# EAGLE design lp_pic32_s (EAGLE 7.5.0)
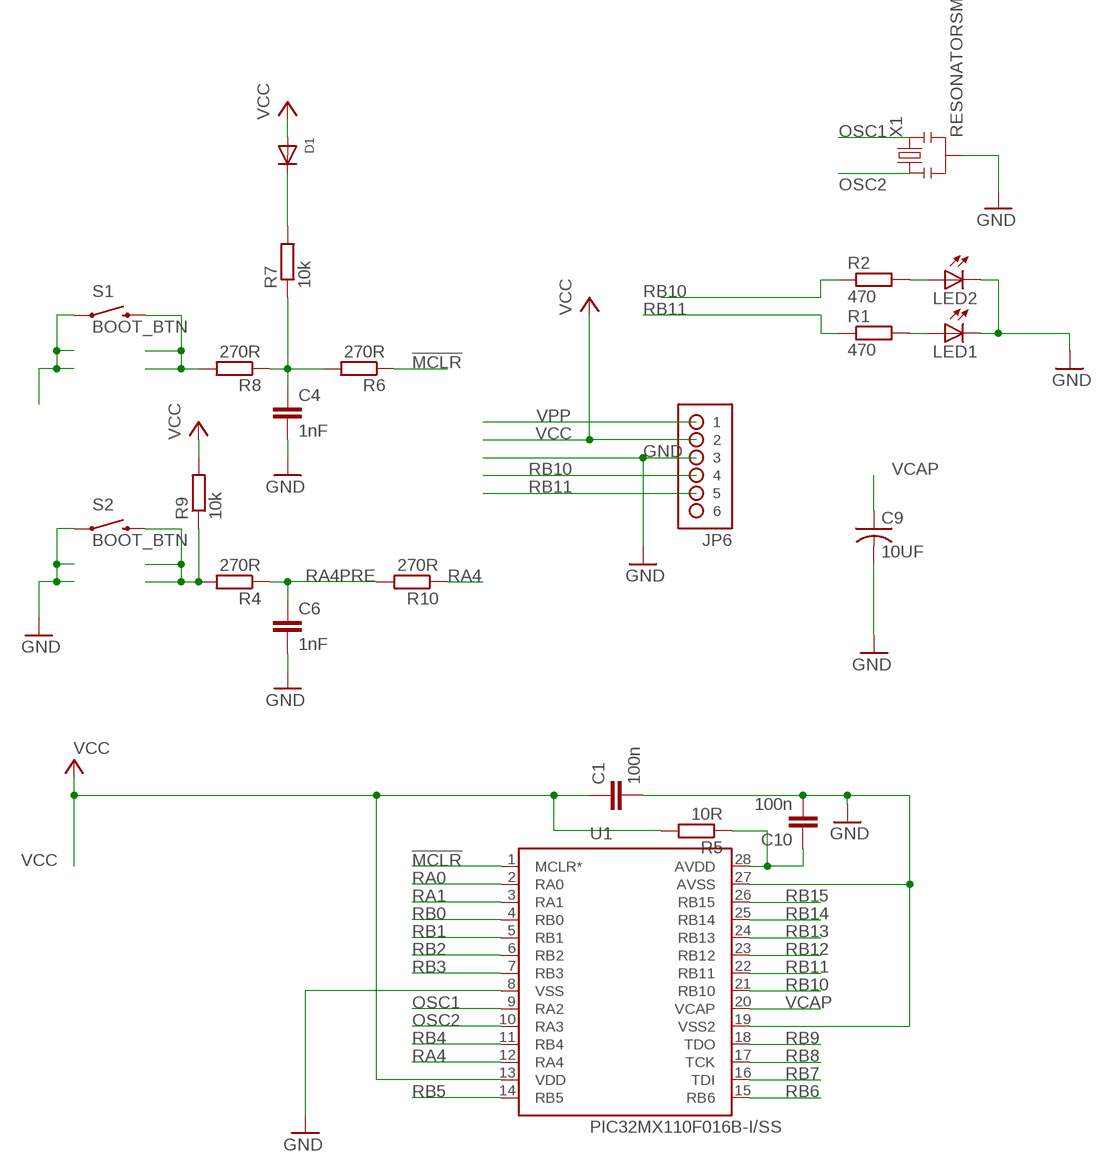
[diagram p0: schematic, sheet 1]

## Parts
C1  100n  C-EUC0805  [C0805]
C4  1nF  C-EUC0805  [C0805]
C6  1nF  C-EUC0805  [C0805]
C9  10UF  C-USC1206  [C1206]
C10  100n  C-EUC0805  [C0805]
D1  DIODESOD-323F  [SOD-323F]
JP6  No Load  HDR-1X6-OFFSET  [HDR-1X6_OFFSET]
LED1  0  LEDCHIPLED_1206  [CHIPLED_1206]
LED2  0  LEDCHIPLED_1206  [CHIPLED_1206]
R1  470  R-EU_R0805  [R0805]
R2  470  R-EU_R0805  [R0805]
R4  270R  R-EU_R0805  [R0805]
R5  10R  R-EU_R0805  [R0805]
R6  270R  R-EU_R0805  [R0805]
R7  10k  R-EU_R0805  [R0805]
R8  270R  R-EU_R0805  [R0805]
R9  10k  R-EU_R0805  [R0805]
R10  270R  R-EU_R0805  [R0805]
S1  BOOT_BTN  SWITCH-MOMENTARY-2-SMD-1101NE  [TACTILE-SWITCH-1101NE]
S2  BOOT_BTN  SWITCH-MOMENTARY-2-SMD-1101NE  [TACTILE-SWITCH-1101NE]
U1  PIC32MX110F016B-I/SS  [SOP65P780X200-28N]
X1  RESONATORSMD  [RESONATOR-SMD]

## Nets
!MCLR: R6.1 U1.1(MCLR*)
GND [GND]: C1.2 C4.2 C6.2 C9.2 C10.2 JP6.3 LED1.C LED2.C S2.1 U1.8(VSS) U1.19(VSS2) U1.27(AVSS) X1.2
N$4: R4.2 R9.1 S2.2
N$5: R8.2 S1.2
N$7: D1.C R7.2
N$8 [VCC]: C10.1 R5.1 U1.28(AVDD)
N$9 [GND]: S1.1
N$13: LED1.A R1.2
N$14: LED2.A R2.2
OSC1: U1.9(RA2) X1.3
OSC2: U1.10(RA3) X1.1
RA0: U1.2(RA0)
RA1: U1.3(RA1)
RA4: R10.1 U1.12(RA4)
RA4PRE: C6.1 R4.1 R10.2
RB0: U1.4(RB0)
RB1: U1.5(RB1)
RB2: U1.6(RB2)
RB3: U1.7(RB3)
RB4: U1.11(RB4)
RB5: U1.14(RB5)
RB6: U1.15(RB6)
RB7: U1.16(TDI)
RB8: U1.17(TCK)
RB9: U1.18(TDO)
RB10: JP6.4 R2.1 U1.21(RB10)
RB11: JP6.5 R1.1 U1.22(RB11)
RB12: U1.23(RB12)
RB13: U1.24(RB13)
RB14: U1.25(RB14)
RB15: U1.26(RB15)
VCAP: C9.1 U1.20(VCAP)
VCC [VCC]: C1.1 D1.A JP6.2 R5.2 R9.2 U1.13(VDD)
VPP: C4.1 JP6.1 R6.2 R7.1 R8.1
Unconnected: JP6.6

## Library data of the parts
C1 C10 = rcl:C-EU: CAPACITOR, European symbol
C4 C6 = resistor:C-EU: CAPACITOR, European symbol
C9 = rcl:C-US: CAPACITOR, American symbol
D1 = adafruit:DIODE: Diode SMADIODE - SMA Surface Mount Package 20V 1A Schottky Diode Digikey: 641-1014-6-ND DO-1N4148 - Through Hole Small Current Diode SOD-123 20V 1 A (.5mV Vf) Schottky Diode - Digikey: MBRX120TPMSCT-ND SOD-323 10V 570mA (.38mV Vf, 3ns) Schottky Diode - Digikey: ZLLS410CT-ND SOD-523 30V 30mA Schottky Diode (RB751S-40TE61) - Digikey: RB751S-40TE61CT-ND SOT23-R/W - SOT23 Package (R = Solder Paste/Reflow Ovens, W = Hand-Soldering) BAT54Film 40V 300mA - Digikey: 497-7162-1-ND
JP6 = Mechanical:HDR-1X6-OFFSET: 42 mil hole pattern with 16mil offset for jtag connector
LED1 LED2 = led:LED: LED OSRAM: - CHIPLED LG R971, LG N971, LY N971, LG Q971, LY Q971, LO R971, LY R971 LH N974, LH R974 LS Q976, LO Q976, LY Q976 LO Q996 - Hyper CHIPLED LW Q18S LB Q993, LB Q99A, LB R99A - SideLED LS A670, LO A670, LY A670, LG A670, LP A670 LB A673, LV A673, LT A673, LW A673 LH A674 LY A675 LS A676, LA A676, LO A676, LY A676, LW A676 LS A679, LY A679, LG A679 - Hyper Micro SIDELED® LS Y876, LA Y876, LO Y876, LY Y876 LT Y87S - SmartLED LW L88C, LW L88S LB L89C, LB L89S, LG L890 LS L89K, LO L89K, LY L89K LS L896, LA L896, LO L896, LY L896 - TOPLED LS T670, LO T670, LY T670, LG T670, LP T670 LSG T670, LSP T670, LSY T670, LOP T670, LYG T670 LG T671, LOG T671, LSG T671 LB T673, LV T673, LT T673, LW T673 LH T674 LS T676, LA T676, LO T676, LY T676, LB T676, LH T676, LSB T676, LW T676 LB T67C, LV T67C, LT T67C, LS T67K, LO T67K, LY T67K, LW E67C LS E67B, LA E67B, LO E67B, LY E67B, LB E67C, LV E67C, LT E67C LW T67C LS T679, LY T679, LG T679 LS T770, LO T770, LY T770, LG T770, LP T770 LB T773, LV T773, LT T773, LW T773 LH T774 LS E675, LA E675, LY E675, LS T675 LS T776, LA T776, LO T776, LY T776, LB T776 LHGB T686 LT T68C, LB T68C - Hyper Mini TOPLED® LB M676 - Mini TOPLED Santana® LG M470 LS M47K, LO M47K, LY M47K Source: http://www.osram.convergy.de LUXEON: - LUMILED® LXK2-PW12-R00, LXK2-PW12-S00, LXK2-PW14-U00, LXK2-PW14-V00 LXK2-PM12-R00, LXK2-PM12-S00, LXK2-PM14-U00 LXK2-PE12-Q00, LXK2-PE12-R00, LXK2-PE12-S00, LXK2-PE14-T00, LXK2-PE14-U00 LXK2-PB12-K00, LXK2-PB12-L00, LXK2-PB12-M00, LXK2-PB14-N00, LXK2-PB14-P00, LXK2-PB14-Q00 LXK2-PR12-L00, LXK2-PR12-M00, LXK2-PR14-Q00, LXK2-PR14-R00 LXK2-PD12-Q00, LXK2-PD12-R00, LXK2-PD12-S00 LXK2-PH12-R00, LXK2-PH12-S00 LXK2-PL12-P00, LXK2-PL12-Q00, LXK2-PL12-R00 Source: www.luxeon.com KINGBRIGHT: KA-3528ASYC Source: www.kingbright.com
R1 R2 R4-R10 = resistor:R-EU_: RESISTOR, European symbol
S1 S2 = SparkFun-Electromechanical:SWITCH-MOMENTARY-2: Various NO switches- pushbuttons, reed, etc
U1 = Microchip-PIC32MX1-2-3-4-5-6-7:PIC32MX: IC,32-bit Microcontrollers (up to 128 KB Flash and 32 KB SRAM) with Audio and Graphics Interfaces, USB, and Advanced Analog; MPN: PIC32MX110F016B-I/SS; OC_FARNELL: 2057067; OC_NEWARK: 39T6776; PACKAGE: 28-Lead SSOP; SUPPLIER: Microchip
X1 = SparkFun02-20-08:RESONATOR: Resonator Small SMD resonator. This is the itty bitty 10/20MHz resonators with built in caps. CSTCE10M0G55 and CSTCE20M0V53. Footprint has been reviewed closely but hasn t been tested yet.'

## Net classes
0 default: width 0.406 mm, drill 0.508 mm
1 GND: width 0.508 mm, drill 0.508 mm
2 VCC: width 1.016 mm, drill 0.508 mm
4 VCCEXT: width 0.762 mm, drill 0.508 mm

## Board
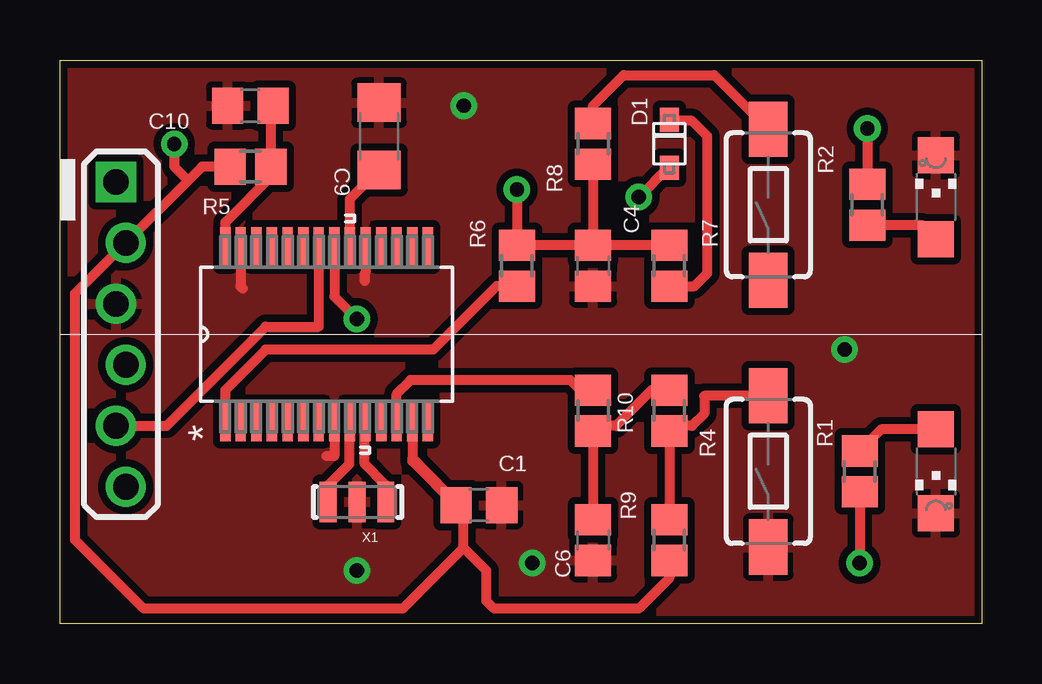
[diagram p1: board, top side]
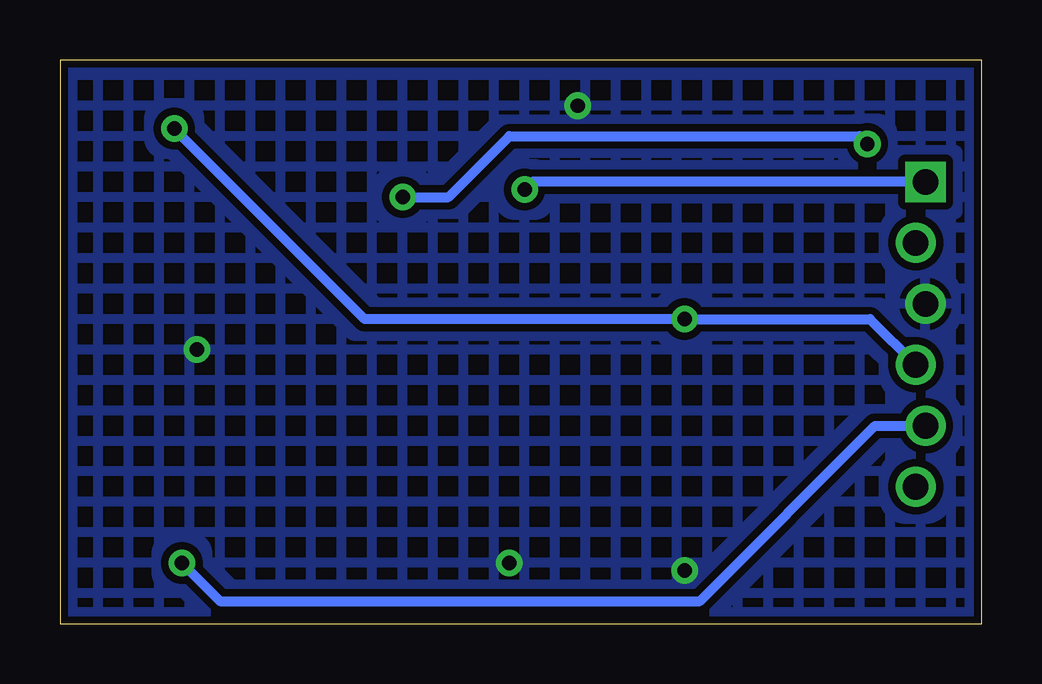
[diagram p2: board, bottom side, seen from below]

Size 38.42 x 23.5 mm. Coordinates in mm from the lower left corner, seen from the top.
Outline: 0,23.5 38.42,23.5 38.42,0 0,0 0,23.5
Copper layers (1*16): Top 0.035mm / dielectric 1.5mm / Bottom 0.035mm
Design rules "SparkFun *": minimum track width 8mil, minimum drill 20mil, track to track 7mil, track to pad 7mil, pad to pad 7mil, via to via 7mil, smd to smd 7mil, copper to edge 10mil, drill to drill 8mil, minimum pad ring 12mil, minimum via ring 10mil, stop-mask expansion 4mil, vias tented up to drill 25mil, thermal gap 10mil

### Footprints (pad centres in the part's own frame; a part is rotated, then mirrored left to right if it is on the bottom)
C0805 = smd 1.3 x 1.5: 1 -0.95,0; 2 0.95,0
C0805' = smd 1.3 x 1.5: 1 -0.85,0; 2 0.85,0
C1206 = smd 1.6 x 1.8: 1 -1.4,0; 2 1.4,0
SOD-323F = smd 1 x 0.8: A -1,0; C 1,0
HDR-1X6_OFFSET = drill 1.067 square: 1 -0.203,6.35 | drill 1.067: 2 0.203,3.81; 3 -0.203,1.27; 4 0.203,-1.27; 5 -0.203,-3.81; 6 0.203,-6.35
CHIPLED_1206 = smd 1.5 x 1.5: A 0,-1.75; C 0,1.75
R0805 = smd 1.3 x 1.5: 1 -0.85,0; 2 0.85,0
TACTILE-SWITCH-1101NE = smd 2.3 x 1.6: 1 -3.15,0; 2 3.15,0
SOP65P780X200-28N = smd 1.651 x 0.432: 1 -3.632,4.216; 2 -3.632,3.581; 3 -3.632,2.921; 4 -3.632,2.286; 5 -3.632,1.626; 6 -3.632,0.965; 7 -3.632,0.33; 8 -3.632,-0.33; 9 -3.632,-0.965; 10 -3.632,-1.626; 11 -3.632,-2.286; 12 -3.632,-2.921; 13 -3.632,-3.581; 14 -3.632,-4.216; 15 3.632,-4.216; 16 3.632,-3.581; 17 3.632,-2.921; 18 3.632,-2.286; 19 3.632,-1.626; 20 3.632,-0.965; 21 3.632,-0.33; 22 3.632,0.33; 23 3.632,0.965; 24 3.632,1.626; 25 3.632,2.286; 26 3.632,2.921; 27 3.632,3.581; 28 3.632,4.216
RESONATOR-SMD = smd 0.7 x 1.7: 1 -1.2,0; 2 0,0; 3 1.2,0

### Placement (x,y rotation side)
C1  17.46,4.95 0 top
C4  1nF  [C0805']  22.22,14.92 270 top
C6  1nF  [C0805']  22.22,3.49 270 top
C9  13.3,20.32 90 top
C10  7.94,21.59 180 top
D1  25.4,20 90 top
JP6  2.54,12.07 0 top
LED1  36.51,6.35 180 top
LED2  36.51,17.78 0 top
R1  33.34,6.35 90 top
R2  33.66,17.46 270 top
R4  25.4,8.89 270 top
R5  7.94,19.05 180 top
R6  19.05,14.92 90 top
R7  25.4,14.92 270 top
R8  22.22,20 90 top
R9  25.4,3.49 270 top
R10  22.22,8.89 270 top
S1  29.53,17.46 90 top
S2  29.53,6.35 90 top
U1  11.11,12.07 90 top
X1  12.38,5.08 180 top

### Tracks (layer width: path | path; a pad name or v marks a point on that pad's centre or on a via)
!MCLR
  Top 0.406: R6.1 18.2,14.07 15.56,11.43 8.57,11.43 6.9,9.75 U1.1
GND  (via drill 0.6)
  Top 0.406: U1.8 11.44,7 11.43,6.99 11.11,6.99 | U1.27 7.53,14.06 7.62,13.97 | U1.19 12.74,14.64 12.7,14.61 12.7,14.29
  other vias: 19.68,2.54 32.7,11.43 12.38,2.22 16.83,21.59
  pour Top (isolate 0.305): -0.25,-0.51 39.12,-0.51 39.12,24 -0.25,24
  pour Bottom (isolate 0.305, hatched): -0.25,-0.51 39.12,-0.51 39.12,24 -0.25,24
N$4
  Top 0.406: S2.2 26.86,9.5 26.86,8.76 26.35,8.26 25.61,8.26 R4.2 R9.1
N$5
  Top 0.406: R8.2 22.22,21.59 23.5,22.86 27.28,22.86 S1.2
N$7
  Top 0.406: R7.2 26.46,14.07 26.99,14.61 26.99,20.32 26.35,20.96 25.45,20.96 D1.C
N$8
  Top 0.406: C10.1 8.79,21.49 R5.1 8.79,18.63 6.9,16.74 U1.28
N$13
  Top 0.406: LED1.A 34.24,8.1 R1.2
N$14
  Top 0.406: LED2.A 35.93,16.61 R2.2
OSC1
  Top 0.406: X1.3 11.18,5.79 12.07,6.67 12.07,8.42 U1.9
OSC2
  Top 0.406: X1.1 13.58,5.79 12.7,6.67 12.7,8.39 U1.10
RA4
  Top 0.406: U1.12 14.03,9.59 14.61,10.16 21.27,10.16 21.69,9.74 R10.1
RA4PRE
  Top 0.406: R4.1 24.66,9.74 23.18,8.26 22.44,8.26 R10.2 C6.1
RB10  (via drill 0.6)
  Top 0.406: U1.21 11.44,13.64 v12.38,12.7 | v33.66,20.64 R2.1
  Bottom 0.406: JP6.4 4.65,12.7 v12.38,12.7 25.72,12.7 v33.66,20.64
RB11  (via drill 0.6)
  Top 0.406: JP6.5 4.45,8.26 8.57,12.38 10.79,12.38 10.79,15.68 U1.22 | R1.1 v33.34,2.54
  Bottom 0.406: 4.13,8.26 JP6.5 4.45,8.26 11.75,0.95 31.75,0.95 v33.34,2.54
VCAP
  Top 0.406: C9.1 12.08,17.69 U1.20
VCC  (via drill 0.6)
  Top 0.406: R5.2 5.92,19.05 5.34,18.47 | 5.34,18.47 JP6.2 0.64,13.77 0.64,3.49 3.49,0.64 14.29,0.64 16.83,3.18 | D1.A 25.35,19 v24.13,17.78 | v4.76,20 4.76,19.05 5.34,18.47 | R9.2 25.4,1.9 24.13,0.64 18.1,0.64 17.78,0.95 17.78,2.22 16.83,3.18 | 16.83,3.18 16.83,4.64 | 16.83,4.64 C1.1 14.69,6.77 U1.13 14.69,6.9 16.83,4.76 16.83,4.64
  Bottom 0.406: v24.13,17.78 22.22,17.78 19.68,20.32 5.08,20.32 v4.76,20
VPP  (via drill 0.6)
  Top 0.406: R8.1 C4.1 | R7.1 C4.1 | C4.1 R6.2 v19.05,18.1
  Bottom 0.406: JP6.1 18.73,18.41 v19.05,18.1